# EAGLE design 802.15.4 AT86RF231-chip (EAGLE 6.2)
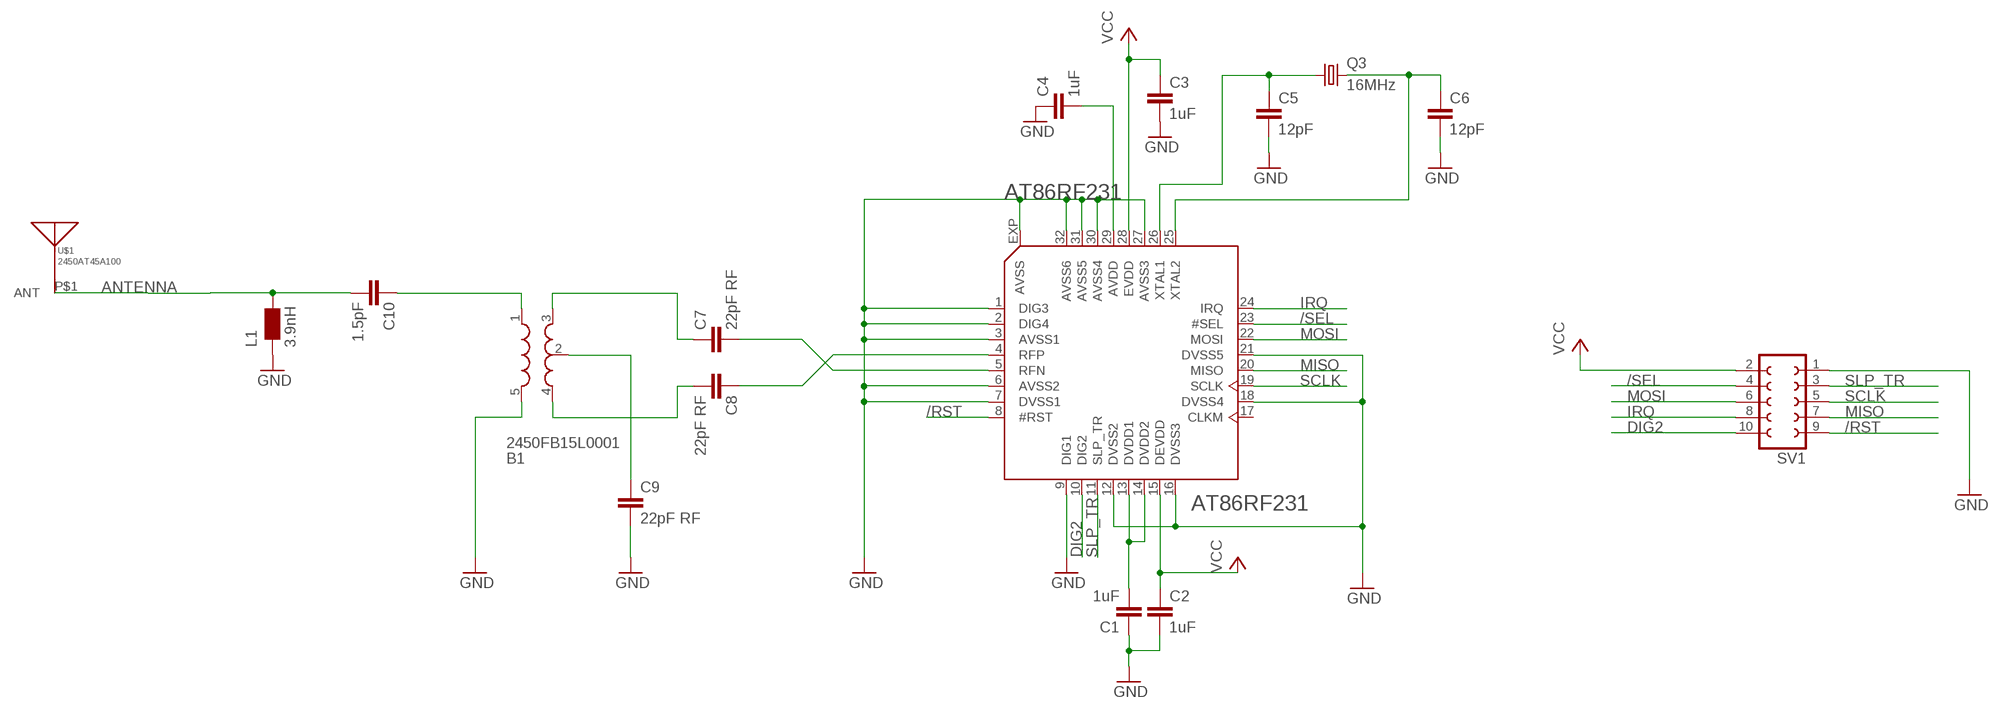
[diagram p0: schematic, sheet 1]

## Parts
AT86RF231  AT86RF231  [QFN32]
B1  2450FB15L0001  BALUN0805  [BALUN]
C1  1uF  C-EUC0402K  [C0402K]
C2  1uF  C-EUC0402K  [C0402K]
C3  1uF  C-EUC0402K  [C0402K]
C4  1uF  C-EUC0402K  [C0402K]
C5  12pF  C-EUC0402K  [C0402K]
C6  12pF  C-EUC0402K  [C0402K]
C7  22pF RF  C-EUC0402K  [C0402K]
C8  22pF RF  C-EUC0402K  [C0402K]
C9  22pF RF  C-EUC0402K  [C0402K]
C10  1.5pF  C-EUC0402K  [C0402K]
L1  3.9nH  WE-CBF_0402  [0402]
Q3  16MHz  CRYSTALCTS406  [CTS406]
SV1  FE05-2  [FE05-2]
U$1  2450AT45A100  [2450AT45A100]

## Nets
/RST: AT86RF231.8(#RST) SV1.9
/SEL: AT86RF231.23(#SEL) SV1.4
ANTENNA: C10.2 L1.2 U$1.P$1(ANT)
AVDD: AT86RF231.29(AVDD) C4.2
DIG2: AT86RF231.10(DIG2) SV1.10
DVDD1: AT86RF231.13(DVDD1) AT86RF231.14(DVDD2) C1.2
GND: AT86RF231.1(DIG3) AT86RF231.2(DIG4) AT86RF231.3(AVSS1) AT86RF231.6(AVSS2) AT86RF231.7(DVSS1) AT86RF231.9(DIG1) AT86RF231.12(DVSS2) AT86RF231.16(DVSS3) AT86RF231.18(DVSS4) AT86RF231.21(DVSS5) AT86RF231.27(AVSS3) AT86RF231.30(AVSS4) AT86RF231.31(AVSS5) AT86RF231.32(AVSS6) AT86RF231.EXP(AVSS) B1.5(GND) C1.1 C2.2 C3.2 C4.1 C5.2 C6.2 C9.2 L1.1 SV1.1
IRQ: AT86RF231.24(IRQ) SV1.8
MISO: AT86RF231.20(MISO) SV1.7
MOSI: AT86RF231.22(MOSI) SV1.6
N$1: AT86RF231.26(XTAL1) C5.1 Q3.1
N$2: AT86RF231.25(XTAL2) C6.1 Q3.3
N$3: AT86RF231.4(RFP) C8.1
N$4: AT86RF231.5(RFN) C7.2
N$5: B1.3(OUT1) C7.1
N$6: B1.4(OUT2) C8.2
N$7: B1.2(GND) C9.1
N$8: B1.1(IN) C10.1
SCLK: AT86RF231.19(SCLK) SV1.5
SLP_TR: AT86RF231.11(SLP_TR) SV1.3
VCC: AT86RF231.15(DEVDD) AT86RF231.28(EVDD) C2.1 C3.1 SV1.2
Unconnected: AT86RF231.17(CLKM)

## Library data of the parts
AT86RF231 = at86rf231:AT86RF231
B1 = SparkFun:BALUN
C1-C10 = rcl:C-EU: CAPACITOR, European symbol
L1 = wuerth-elektronik:WE-CBF: SMD EMI Suppression Ferrite Beads - excellent anti-EMI properties - low DCR - impedances till 3000 ohms - rated current up to 6 A
Q3 = crystal:CRYSTAL: CRYSTAL
SV1 = con-lsta:FE05-2: FEMALE HEADER
U$1 = johanson:2450AT45A100

## Board
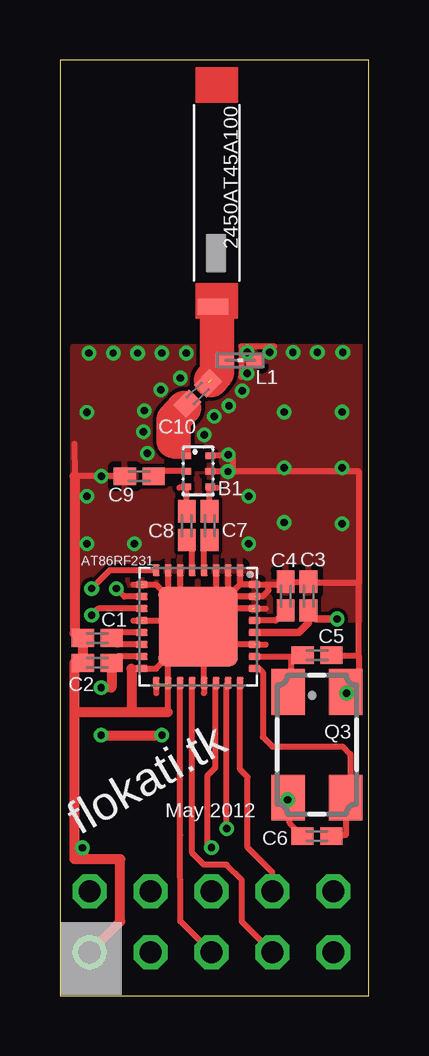
[diagram p1: board, top side]
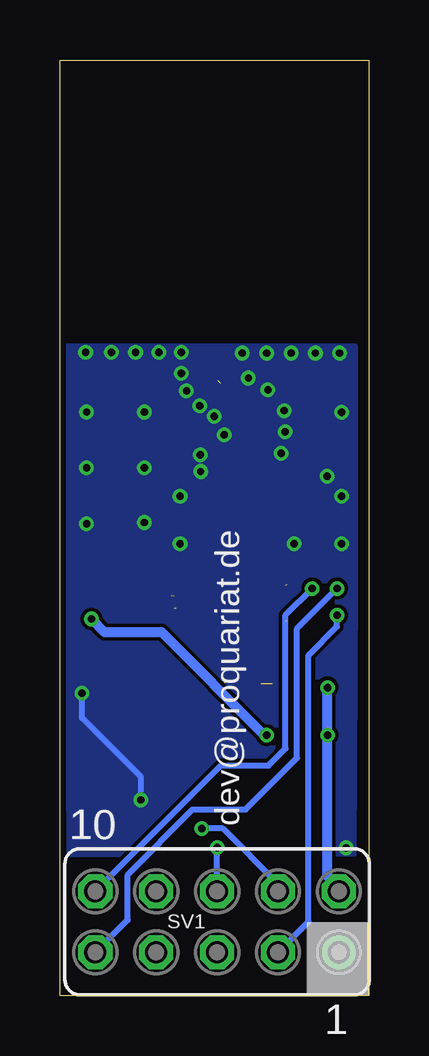
[diagram p2: board, bottom side, seen from below]

Size 12.88 x 39 mm. Coordinates in mm from the lower left corner, seen from the top.
Outline: 0,0 12.88,0 12.88,39 0,39 0,0
Copper layers (1*16): Top 0.035mm / dielectric 1.5mm / Bottom 0.035mm
Design rules: minimum track width 6mil, minimum drill 12mil, track to track 6mil, track to pad 6mil, pad to pad 6mil, via to via 6mil, smd to smd 0mil, copper to edge 10mil, drill to drill 10mil, minimum pad ring 10mil, minimum via ring 6mil, stop-mask expansion 2mil, vias tented up to drill 100mil, thermal gap 10mil
tRestrict: area 5.5,21.9 to 6,23

### Footprints (pad centres in the part's own frame; a part is rotated, then mirrored left to right if it is on the bottom)
QFN32 = smd 0.5 x 0.3: 1 -2.35,1.75; 2 -2.35,1.25; 3 -2.35,0.75; 4 -2.35,0.25; 5 -2.35,-0.25; 6 -2.35,-0.75; 7 -2.35,-1.25; 8 -2.35,-1.75; 17 2.35,-1.75; 18 2.35,-1.25; 19 2.35,-0.75; 20 2.35,-0.25; 21 2.35,0.25; 22 2.35,0.75; 23 2.35,1.25; 24 2.35,1.75 | smd 0.3 x 0.5: 9 -1.75,-2.35; 10 -1.25,-2.35; 11 -0.75,-2.35; 12 -0.25,-2.35; 13 0.25,-2.35; 14 0.75,-2.35; 15 1.25,-2.35; 16 1.75,-2.35; 25 1.75,2.35; 26 1.25,2.35; 27 0.75,2.35; 28 0.25,2.35; 29 -0.25,2.35; 30 -0.75,2.35; 31 -1.25,2.35; 32 -1.75,2.35 | smd 3.3 x 3.3: EXP 0,0
BALUN = smd 0.27 x 0.4: 1 -0.7,-0.5; 2 -0.05,-0.5; 3 0.6,-0.5; 4 0.6,0.5; 5 -0.05,0.5; 6 -0.7,0.5
C0402K = smd 0.925 x 0.74: 1 -0.6,0; 2 0.6,0
0402 = smd 0.7 x 0.6: 1 -0.6,0; 2 0.6,0
CTS406 = smd 1.9 x 1.4: 1 -2.2,-1.2; 2 2.2,-1.2; 3 2.2,1.2; 4 -2.2,1.2
FE05-2 = drill 0.914: 1 -5.08,1.27 | drill 0.914 octagon: 2 -5.08,-1.27; 3 -2.54,1.27; 4 -2.54,-1.27; 5 0,1.27; 6 0,-1.27; 7 2.54,1.27; 8 2.54,-1.27; 9 5.08,1.27; 10 5.08,-1.27
2450AT45A100 = smd 1.27 x 0.635: P$1 -0.508,-4.572

### Placement (x,y rotation side)
AT86RF231  5.77,15.38 270 top
B1  5.77,21.81 270 top
C1  1.56,14.9 0 top
C2  1.56,13.87 180 top
C3  10.37,16.65 90 top
C4  9.42,16.65 270 top
C5  10.72,14.19 0 top
C6  10.72,6.65 180 top
C7  5.29,19.59 270 top
C8  6.24,19.59 90 top
C9  3.31,21.65 180 top
C10  5.75,25.1 45 top
L1  7.52,26.48 180 top
Q3  10.72,10.46 270 top
SV1  6.32,3.08 180 bottom
U$1  6.91,33.29 0 top

### Tracks (layer width: path | path; a pad name or v marks a point on that pad's centre or on a via)
/RST  (via drill 0.3 pad 0.25)
  Top 0.254: AT86RF231.8 2.08,17.73 v1.32,16.97
  Bottom 0.254: SV1.9 10.05,3.16 10.05,5.04 7.35,7.76 5.13,7.76 2.99,9.9 2.99,15.3 v1.32,16.97
/SEL  (via drill 0.3 pad 0.25)
  Top 0.254: v6.96,6.97 6.96,12.97 AT86RF231.23
  Bottom 0.254: SV1.4 3.78,4.66 6.08,6.97 v6.96,6.97
ANTENNA  (1 unrouted)
  Top 0.254: L1.2 6.6,26.48 6.55,26.43
  Top 1.448: U$1.P$1 6.55,28.71 6.55,26.99 6.55,26.43 6.55,25.97 6.3,25.67
AVDD
  Top 0.254: C4.2 9,15.63 AT86RF231.29
DIG2  (via drill 0.3 pad 0.25)
  Top 0.254: AT86RF231.10 2.69,16.63 v2.35,16.97
  Bottom 0.254: SV1.10 6.16,9.59 4.18,9.59 3.46,10.3 3.46,15.86 v2.35,16.97
DVDD1
  Top 0.254: AT86RF231.14 2.43,14.63 arc-90 C1.2 arc-90 2.38,15.13 AT86RF231.13
GND  (via drill 0.3, 0.3 pad 0.25)  (7 unrouted)
  Top 0.254: AT86RF231.7 4.52,16.87 4.57,16.81 4.57,16.57 4.81,16.33 | 4.81,16.33 AT86RF231.EXP | AT86RF231.6 5.02,16.53 4.81,16.33 | AT86RF231.9 4.02,17.13 AT86RF231.EXP | AT86RF231.1 7.52,17.13 | 7.52,17.13 7.02,16.63 | 7.02,16.63 AT86RF231.EXP | AT86RF231.2 7.02,16.63 | AT86RF231.3 6.52,16.13 | 7.52,17.13 AT86RF231.32 9.3,17.13 C4.1 C3.2 10.4,17.21 12.46,17.21 | AT86RF231.EXP 4.02,13.63 AT86RF231.16 2.99,13.63 | AT86RF231.18 4.52,14.13 AT86RF231.EXP | AT86RF231.21 6.02,15.13 AT86RF231.EXP | AT86RF231.27 6.52,14.63 AT86RF231.EXP | AT86RF231.12 5.52,15.63 AT86RF231.EXP | AT86RF231.30 6.52,16.13 | 6.52,16.13 AT86RF231.EXP | AT86RF231.31 7.02,16.63 | 7.02,16.63 AT86RF231.EXP | 12.46,14.19 12.46,17.21 | C5.2 12.46,14.19 | 12.46,14.19 12.46,12.98 v11.96,12.6 | C6.2 10.13,6.65 9.58,7.2 9.58,8.24 | 9.58,8.24 9.73,8.39 | 9.58,8.24 v9.5,8.16 | B1.5 12.46,21.86 12.46,17.21 | C9.2 0.61,21.65 0.6,23 | 0.61,15.11 C1.1 | 0.61,13.87 C2.2 | 4.5,13 4.5,11.81 | 4.02,13 4.02,12.6 | 6,13.08 6,12.6 | 8.13,14.63 8.58,14.63 | 8.04,16.13 8.59,16.13 | 3.46,15.62 3.07,15.62 | 3.46,17.13 3.07,17.13 | 8.23,16.65 8.46,16.65 8.7,16.89 8.7,17.13 | 6.32,22.52 7.19,22.52 7.19,21.89 | 8.94,27.06 7.57,27.06 7.57,25.79
  Top 0.305: v0.94,6.16 0.96,6.16 0.96,6.13
  Top 0.406: 0.61,21.65 0.61,15.11 | C2.2 C1.1 | SV1.1 2.51,3.08 2.51,5.68 0.61,5.68 0.61,11.81 | 0.61,11.81 0.61,13.87 | 4.5,11.81 2.99,11.81 | 2.99,11.81 0.61,11.81 | 2.99,13.63 2.99,11.81 | 0.61,6.13 0.96,6.13 0.96,5.7
  Bottom 0.254: v9.5,8.16 9.5,9.11 11.96,11.57 v11.96,12.6
  other vias: 7.6,25.21 1.12,20.82 1.12,18.83 3.11,18.83 1.13,24.32 7.82,26.81 11.8,26.81 11.77,24.33 11.77,22 9.35,19.72 11.77,19.67 7.87,18.83 7.87,20.82 5.02,25.74 4.2,25.25 7.05,24.59 6.44,24.14 7.02,22.54 7.01,21.84 1.73,21.65 3.52,24.38 5.27,26.78 7.82,25.94 4.25,26.78 3.24,26.78 2.22,26.78 10.74,26.81 9.72,26.81 1.21,26.78 8.76,26.81 9.35,24.33 9.35,22 3.64,22.61 3.48,23.51 6.02,23.38
  pour Top: 0.56,17.03 0.56,27.06 12.62,27.06 12.62,15.69 12.63,15.66 5.77,15.63 4.11,16.9 3.99,17.03
  pour Bottom: 0.56,17.03 0.56,27.06 12.62,27.06 12.5,5.91 8.35,5.91 3.52,5.99 0.61,5.92
IRQ
  Top 0.254: SV1.8 8.86,5.14 7.83,6.17 7.83,9.11 7.51,9.43 AT86RF231.24
MISO
  Top 0.254: SV1.7 7.59,3.08 7.59,4.82 6.96,5.46 6,5.46 5.52,5.95 AT86RF231.20
MOSI  (via drill 0.3 pad 0.25)
  Top 0.254: v6.32,6.17 6.16,6.33 6.16,9.19 6.48,9.51 6.48,12.99 AT86RF231.22
  Bottom 0.254: SV1.6 v6.32,6.17
N$1
  Top 0.254: AT86RF231.26 9.63,14.13 | 9.63,14.13 9.96,14.13 C5.1 | 9.63,14.13 9.63,12.67 Q3.1
N$2
  Top 0.254: AT86RF231.25 8.31,13.63 8.46,13.47 8.46,10.78 8.86,10.38 11.8,10.38 12.12,10.06 12.12,8.33 Q3.3 11.92,6.68 C6.1
N$3
  Top 0.254: AT86RF231.4 6.02,18.76 C8.1
N$4
  Top 0.254: AT86RF231.5 5.52,18.76 C7.2
N$5
  Top 0.254: C7.1 5.29,21.17 | 5.29,21.17 5.29,21.19 B1.3 | 5.29,21.17 4.97,21.17
N$6
  Top 0.254: C8.2 6.24,21.17 | 6.24,21.17 6.24,21.19 B1.4 | 6.24,21.17 6.56,21.17
N$7
  Top 0.254: B1.2 4.35,21.86 C9.1
N$8
  Top 0.305: B1.1 5.31,22.55 | 5.31,22.55 5.31,23.13 5.31,22.55 | 5.31,22.55 5.31,22.54 4.75,22.54 4.75,23.13 | C10.1 5.32,24.4 5.18,24.5
  Top 1.448: 5.18,24.5 4.75,24.02 4.75,23.13
SCLK
  Top 0.254: SV1.5 5.05,3.08 5.03,3.09 5.02,6.68 AT86RF231.19
SLP_TR  (via drill 0.3 pad 0.25)
  Top 0.254: AT86RF231.11 1.59,16.13 v1.32,15.86
  Bottom 0.254: SV1.3 2.51,3.08 2.51,14.19 1.32,15.38 v1.32,15.86 1.36,15.9
VCC  (via drill 0.3 pad 0.25)
  Top 0.254: 10.37,15.54 10.37,15.86 | 10.37,15.86 10.37,16.01 | 10.37,16.01 C3.1 | 10.37,15.86 10.53,16.01 | AT86RF231.15 2.42,14.13 arc90 C2.1 | 10.69,15.7 10.37,16.01
  Top 0.305: AT86RF231.28 9.96,15.13 10.37,15.54 | v11.56,15.7 10.69,15.7
  Top 0.406: C2.1 2.15,12.84 v1.72,12.84 | v1.72,10.86 v4.26,10.86
  Bottom 0.254: v4.26,10.86 4.34,10.86
  Bottom 0.406: SV1.2 1.72,4.98 v1.72,10.86 v1.72,12.84 | 4.34,10.86 8.62,15.14 11,15.14 v11.56,15.7

### Text on the board
tPlace: May 2012 | flokati.tk
bPlace: dev@proquariat.de